# EasyEDA Pro project ProPrj_龙珠雷达_2024-11-02.epro

# Schematic SCH_龙珠雷达
Board Name: 龙珠雷达; Create Date: 2024-04-22; Page Name: P1; Project Name: 龙珠雷达; Schematic Name: SCH_龙珠雷达; Update Date: 2024-10-24; Company: 嘉立创EDA; Page Size: A4; Version: V1.0
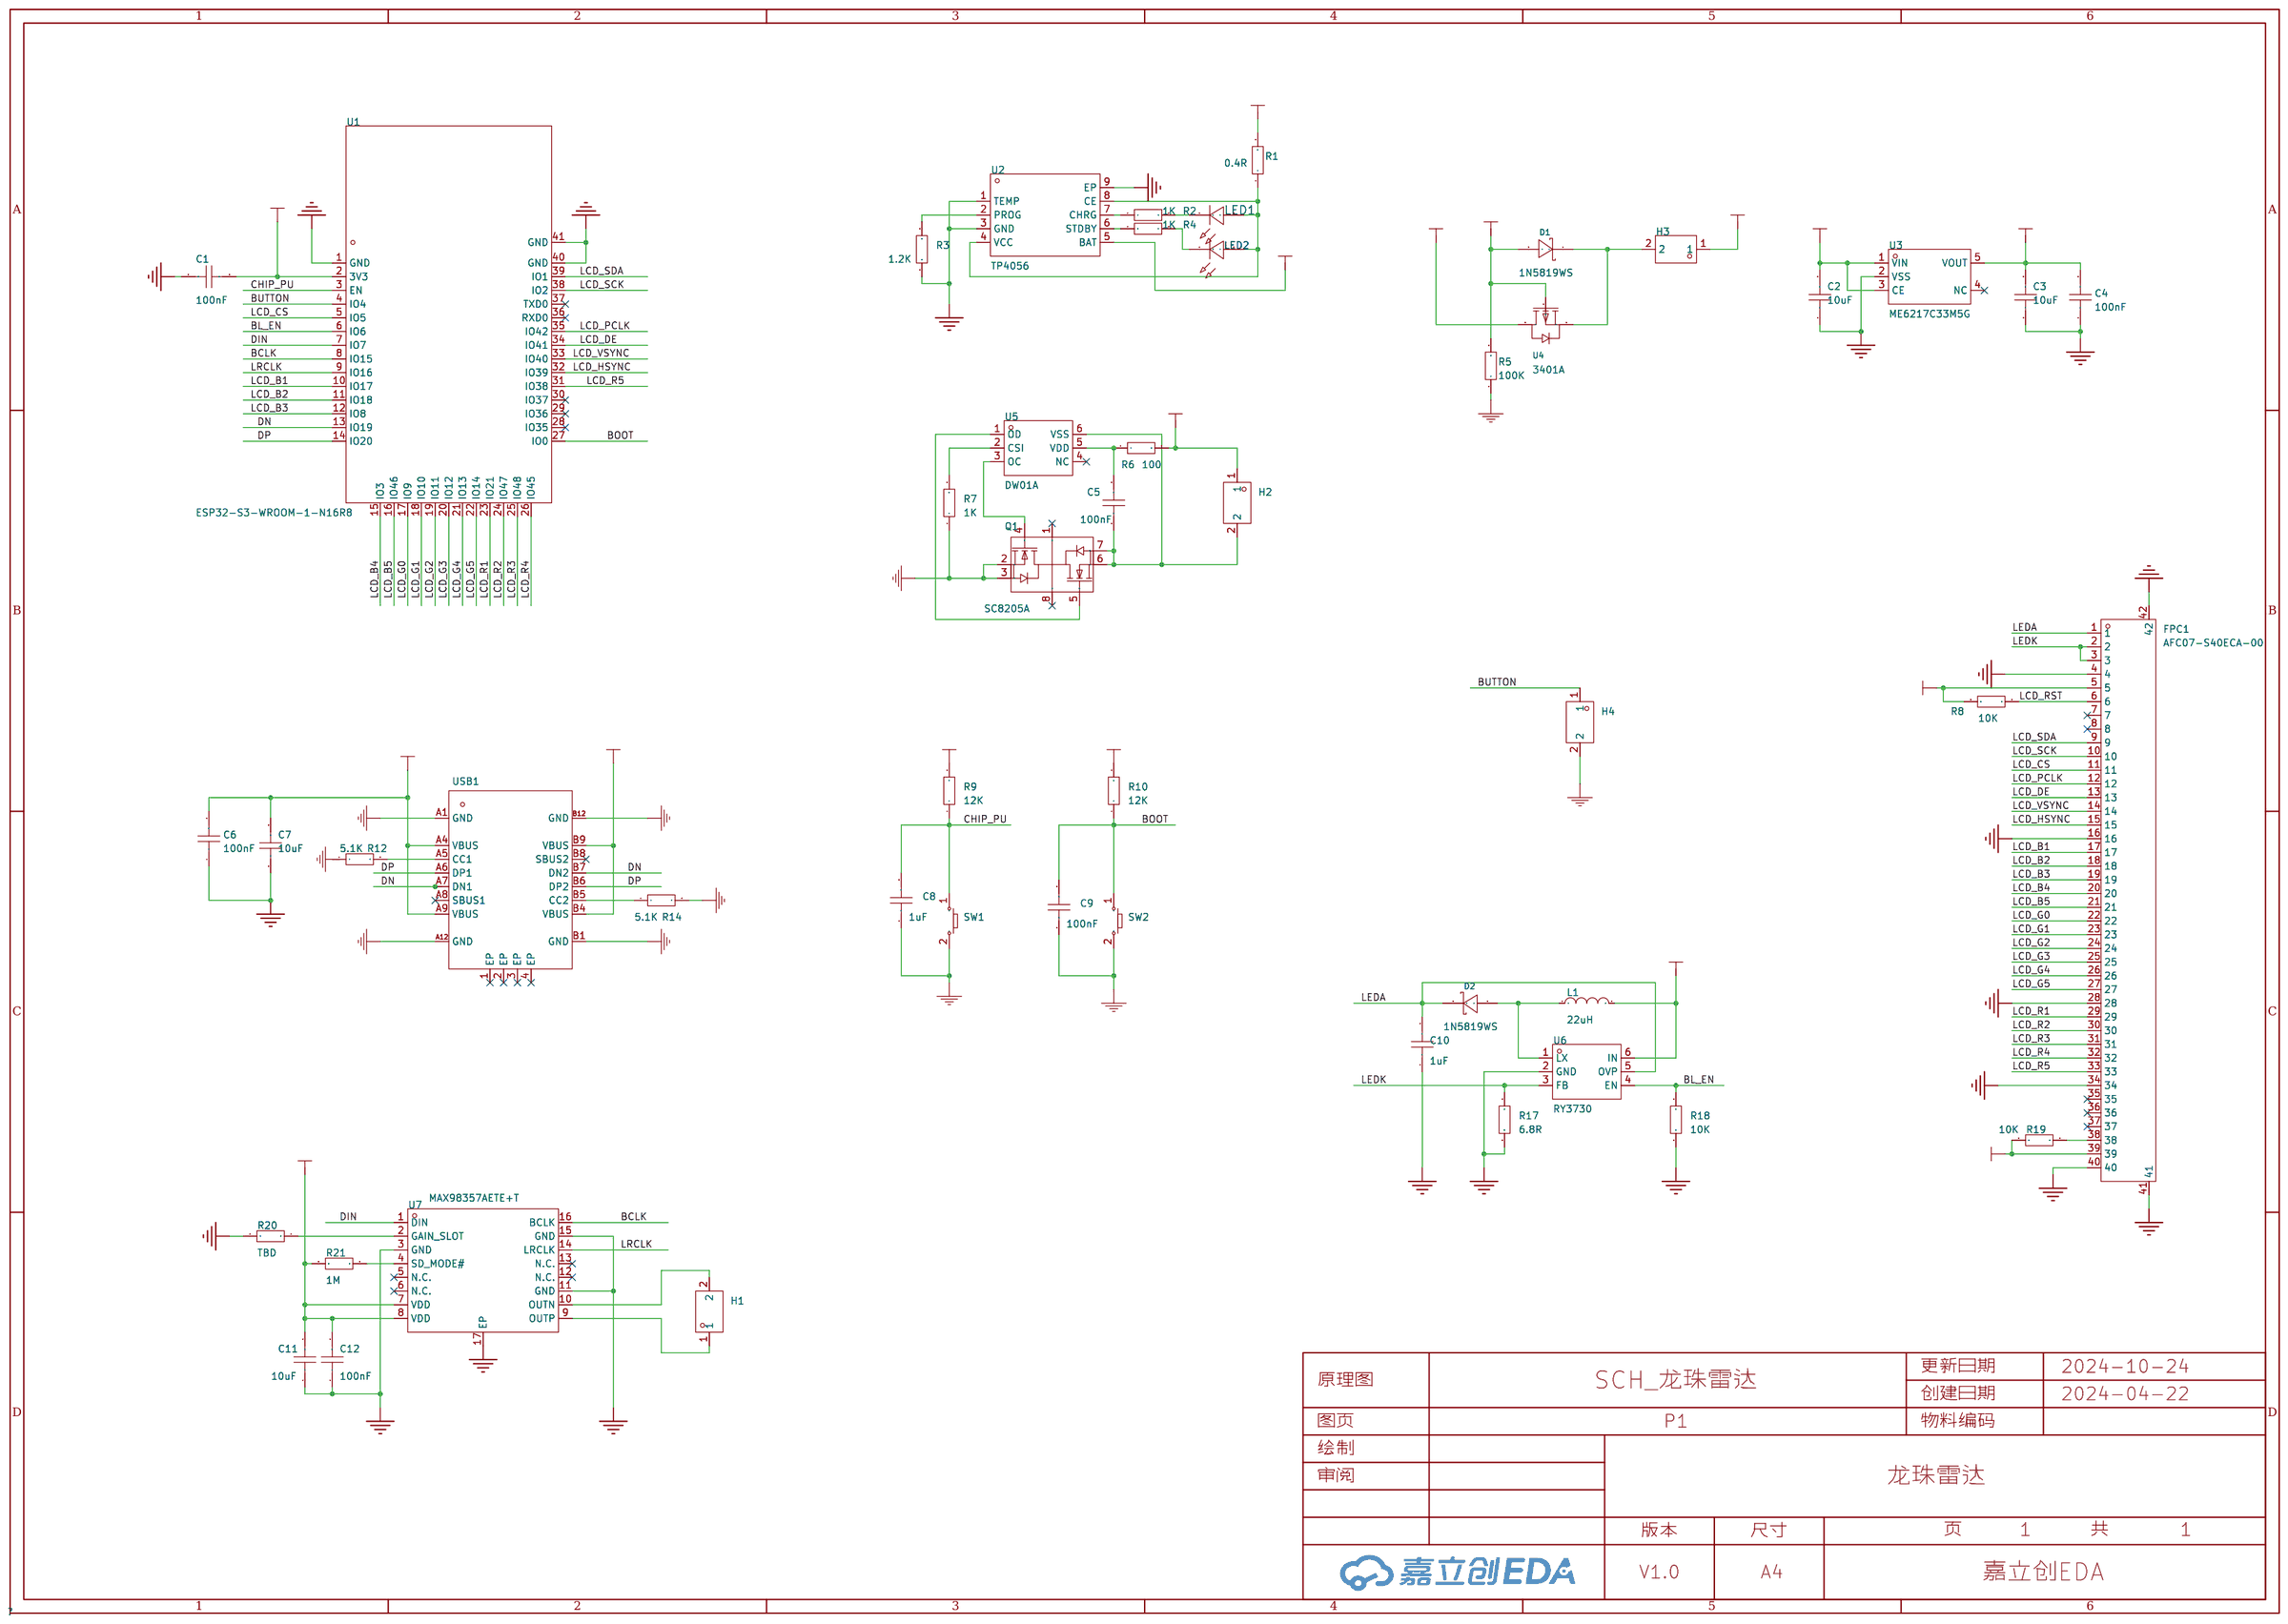
[diagram p0: schematic sheet]

## Parts
C1  100nF  [C0603]
C2  10uF  [C1206]
C3  10uF  [C1206]
C4  100nF  [C0603]
C5  100nF  [C0603]
C6  100nF  [C0603]
C7  10uF  [C1206]
C8  1uF  [C0603]
C9  100nF  [C0603]
C10  1uF  [C0603]
C11  10uF  [C0805]
C12  100nF  [C0603]
D1  1N5819WS  [SOD-323_L1.8-W1.3-LS2.5-RD]
D2  1N5819WS  [SOD-323_L1.8-W1.3-LS2.5-RD]
FPC1  AFC07-S40ECA-00  [FPC-SMD_P0.50-40P_LCS-SJ-H2.0]
H1  -  [HDR-TH_2P-P2.54-V-M-2]
H2  -  [HDR-TH_2P-P2.54-V-M-2]
H3  -  [HDR-TH_2P-P2.54-V-M-2]
H4  -  [HDR-TH_2P-P2.54-V-M-2]
L1  22uH  [IND-SMD_L4.5-W4.0_CD43]
LED1  -  [LED_0603]
LED2  -  [LED_0603]
Q1  SC8205A  [TSSOP-8_L4.4-W3.0-P0.65-LS6.4-BL]
R1  0.4R  [R0603]
R2  1K  [R0603]
R3  1.2K  [R0603]
R4  1K  [R0603]
R5  100K  [R0603]
R6  100  [R0603]
R7  1K  [R0603]
R8  10K  [R0603]
R9  12K  [R0603]
R10  12K  [R0603]
R12  5.1K  [R0603]
R14  5.1K  [R0603]
R17  6.8R  [R0603]
R18  10K  [R0603]
R19  10K  [R0603]
R20  TBD  [R0603]
R21  1M  [R0603]
SW1  -  [Key_SMD_3x4x2]
SW2  -  [Key_SMD_3x4x2]
U1  ESP32-S3-WROOM-1-N16R8  [WIRELM-SMD_ESP32-S3-WROOM-1]
U2  TP4056  [ESOP-8_L4.9-W3.9-P1.27-LS6.0-BL-EP]
U3  ME6217C33M5G  [SOT-23-5_L3.0-W1.7-P0.95-LS2.8-BR]
U4  3401A  [SOT-23-3_L2.9-W1.3-P1.90-LS2.4-BR]
U5  DW01A  [SOT-23-6_L2.9-W1.6-P0.95-LS2.8-BL]
U6  RY3730  [SOT-23-6_L2.9-W1.6-P0.95-LS2.8-BL]
U7  MAX98357AETE+T  [TQFN-16_L3.0-W3.0-P0.50-BL-EP1.5]
USB1  -  [USB_TYPE-C-16P]

## Library data of the parts
C1 C4-C6 C8-C10 C12 = CAP_0603: Supplier Footprint: 0603
C2 C3 C7 = CAP_1206: Supplier Footprint: 1206
C11 = CAP_0805: Supplier Footprint: 0805
D1 D2 = 1N5819WS_C191023: 直流反向耐压(Vr):40V;平均整流电流(Io):1A;正向压降(Vf):600mV@1A;; LCSC Part Name: 40V 1A 600mV@1A; Supplier Part: C191023; Manufacturer: Hottech(合科泰); Supplier Footprint: SOD-323; JLCPCB Part Class: 基础库; Datasheet: https://atta.szlcsc.com/upload/public/pdf/source/20220428/3CB86FD8D28D653594B4E35F9D5AEFD9.pdf; Supplier: LCSC; Reverse Voltage (Vr): 40V; Average Rectified Current (Io): 1A; Forward Voltage (Vf@If): 600mV@1A
FPC1 = AFC07-S40ECA-00: 锁定特性:抽屉式;触点类型:上接;触点数量:40P;间距:0.5mm;安装类型:卧贴;; LCSC Part Name: 间距:0.5mm P数:40P 抽屉式 上接; Supplier Part: C262648; Manufacturer: JS(钜硕电子); Supplier Footprint: SMD,P=0.5mm,卧贴; JLCPCB Part Class: 扩展库; Datasheet: https://atta.szlcsc.com/upload/public/pdf/source/20190726/C11082_A2E7B12387019CE4314BB5199EE0FDF4.pdf; Supplier: LCSC; Locking Feature: 抽屉式; Contact Type: 上接; Number of Contacts: 40P; Pitch: 0.5mm; Mounting Type: 卧贴; FFC, FCB Thickness: 0.3mm; Height Above Board: 2mm
H1-H4 = HDR-M_2.54_2x1: Supplier Part: C2883961; Supplier Footprint: 插件,P=2.54mm
L1 = CD43-220M 22UH: 电感值:22uH;精度:±20%;额定电流:760mA;类型:-;; LCSC Part Name: 22uH ±20%; Supplier Part: C2826645; Manufacturer: DMBJ(振宝佳); Supplier Footprint: SMD; JLCPCB Part Class: 扩展库; Datasheet: https://atta.szlcsc.com/upload/public/pdf/source/20210416/C2826610_BD9EF4281FEC8102FBF66339CC69A197.pdf; Supplier: LCSC; Tolerance: ±20%; Rated Current: 760mA; DC Resistance (DCR): 378mΩ
LED1 = LED_0603-R: Supplier Footprint: 0603
LED2 = LED_0603-G: Supplier Footprint: 0603
Q1 = SC8205A: 类型:N沟道;漏源电压(Vdss):20V;连续漏极电流(Id):6A;功率(Pd):2W;导通电阻(RDS(on)@Vgs,Id):25mΩ@10V,5A;阈值电压(Vgs(th)@Id):1.5V@250uA;; LCSC Part Name: N沟道 耐压:20V 电流:6A; Supplier Part: C83931; Manufacturer: FM(富满); Supplier Footprint: TSSOP-8; JLCPCB Part Class: 扩展库; Datasheet: https://atta.szlcsc.com/upload/public/pdf/source/20161024/1477288575793.pdf; Supplier: LCSC; Type: N沟道; Drain Source Voltage (Vdss): 20V; Continuous Drain Current (Id): 6A; Power Dissipation (Pd): 2W; Drain Source On Resistance (RDS(on)@Vgs,Id): 25mΩ@10V,5A; Gate Threshold Voltage (Vgs(th)@Id): 1.5V@250uA
R1-R10 R12 R14 R17-R21 = Res_0603: Supplier Footprint: 0603
SW1 SW2 = Key_SMD_3x4x2: Supplier Footprint: SMD
U1 = ESP32-S3-WROOM-1-N16R8: LCSC Part Name: 通用型Wi-Fi+低功耗蓝牙MCU模组; Supplier Part: C2913202; Manufacturer: ESPRESSIF(乐鑫); Supplier Footprint: SMD,18x25.5mm; JLCPCB Part Class: 扩展库; Datasheet: https://atta.szlcsc.com/upload/public/pdf/source/20220705/4E799F39581577F766659887F738A439.pdf; Supplier: LCSC
U2 = TP4056: Supplier Part: C9900002169; Supplier Footprint: ESOP-8; JLCPCB Part Class: 扩展库; Supplier: LCSC
U3 = ME6217C33M5G: 输出类型:固定;最大输入电压:7V;输出电压:3.3V;最大输出电流:800mA;电源纹波抑制比(PSRR):65dB@(1kHz);输出极性:正极;; LCSC Part Name: 输入7V 输出3.3V 800mA; Supplier Part: C427602; Manufacturer: MICRONE(南京微盟); Supplier Footprint: SOT-23-5; JLCPCB Part Class: 扩展库; Datasheet: https://atta.szlcsc.com/upload/public/pdf/source/20190910/C427602_D4B9162A2E9D9EF57C60010DFDECEF37.pdf; Supplier: LCSC; Output Type: 固定; Maximum Input Voltage: 7V; Output Voltage: 3.3V; MAX Output Current: 800mA; Power Supply Rejection Ratio (PSRR): 65dB@(1kHz); Dropout Voltage: 180mV@(300mA); Output Polarity: 正极; Number of Outputs: 1
U4 = 3401A: 类型:P沟道;漏源电压(Vdss):30V;连续漏极电流(Id):4.5A;导通电阻(RDS(on)@Vgs,Id):42mΩ;阈值电压(Vgs(th)@Id):1.3V;; LCSC Part Name: P沟道 耐压:30V 电流:4.5A; Supplier Part: C7431447; Manufacturer: HL(富海微); Supplier Footprint: SOT23; Datasheet: https://atta.szlcsc.com/upload/public/pdf/source/20230621/9CFCE0F782A34BEA1E30307D63B2C6A9.pdf; Supplier: LCSC; Type: P沟道; Drain Source Voltage (Vdss): 30V; Continuous Drain Current (Id): 4.5A; Drain Source On Resistance (RDS(on)@Vgs,Id): 42mΩ; Gate Threshold Voltage (Vgs(th)@Id): 1.3V
U5 = DW01A: 电源电压:-300mV~8V;最大充电电流:-;电池类型:锂离子/聚合物;电池节数:1;; Supplier Part: C2927799; Manufacturer: YONGYUTAI(永裕泰); Supplier Footprint: SOT-23-6; JLCPCB Part Class: 扩展库; Datasheet: https://atta.szlcsc.com/upload/public/pdf/source/20211207/8DC9CB9A742765EFB66910D35511359F.pdf; Supplier: LCSC; The Chip Type: 电池保护芯片; Supply Voltage: -300mV~8V; Type of Battery: 锂离子/聚合物; Number of Cells: 1; Operating Temperature: -40℃~+85℃
U6 = RY3730: LCSC Part Name: RY3730 WLED Driver, 2.5-5.5V, 8Series WLED Driver, 1.2MHz, SOT23-6; Supplier Part: C370887; Manufacturer: RYCHiP(蕊源); Supplier Footprint: SOT-23-6; JLCPCB Part Class: 扩展库; Datasheet: https://atta.szlcsc.com/upload/public/pdf/source/20190329/C370887_F149D316440A2ABDFE08FA1E0696DEE8.pdf; Supplier: LCSC
U7 = MAX98357AETE+T: 功放类型:-;扬声器通道数:单声道;输出功率:3.2Wx2@4Ω;; Supplier Part: C910544; Manufacturer: ADI(亚德诺)/MAXIM(美信); Supplier Footprint: TQFN-16-EP(3x3); JLCPCB Part Class: 扩展库; Datasheet: https://atta.szlcsc.com/upload/public/pdf/source/20210106/C910544_CB6DE4B2CEE254A72E6BDB40E718D281.pdf; Supplier: LCSC; Speaker Channels: 单声道; Output Power: 3.2Wx2@4Ω; Supply Voltage: 2.5V~5.5V; Operating Temperature: -40℃~+85℃
USB1 = USB_TYPE-C-16P: Supplier Footprint: SMD

## Nets
3V3: C1.1 C3.2 C4.2 FPC1.5 FPC1.39 R8.2 R9.2 R10.2 R19.2 U1.2(3V3) U3.5(VOUT)
GND: C1.2 C2.1 C3.1 C4.1 C6.1 C7.1 C8.1 C9.1 C10.1 C11.1 C12.1 FPC1.4 FPC1.16 FPC1.28 FPC1.34 FPC1.40 FPC1.41 FPC1.42 H4.2 Q1.2(S1) Q1.3(S1) R3.1 R5.1 R7.1 R12.1 R14.2 R17.2 R18.2 R20.2 SW1.2 SW2.2 U1.1(GND) U1.40(GND) U1.41(GND) U2.1(TEMP) U2.3(GND) U2.9(EP) U3.2(VSS) U6.2(GND) U7.3(GND) U7.11(GND) U7.15(GND) U7.17(EP) USB1.A1(GND) USB1.A12(GND) USB1.B1(GND) USB1.B12(GND)
BAT+: H2.1 R6.2 U2.5(BAT) U4.3(D)
BCLK: U1.8(IO15) U7.16(BCLK)
BL_EN: R18.1 U1.6(IO6) U6.4(EN)
BOOT: C9.2 R10.1 SW2.1 U1.27(IO0)
BUTTON: H4.1 U1.4(IO4)
CHIP_PU: C8.2 R9.1 SW1.1 U1.3(EN)
DIN: U1.7(IO7) U7.1(DIN)
DN: U1.13(IO19) USB1.A7(DN1) USB1.B7(DN2)
DP: U1.14(IO20) USB1.A6(DP1) USB1.B6(DP2)
LCD_B1: FPC1.17 U1.10(IO17)
LCD_B2: FPC1.18 U1.11(IO18)
LCD_B3: FPC1.19 U1.12(IO8)
LCD_B4: FPC1.20 U1.15(IO3)
LCD_B5: FPC1.21 U1.16(IO46)
LCD_CS: FPC1.11 U1.5(IO5)
LCD_DE: FPC1.13 U1.34(IO41)
LCD_G0: FPC1.22 U1.17(IO9)
LCD_G1: FPC1.23 U1.18(IO10)
LCD_G2: FPC1.24 U1.19(IO11)
LCD_G3: FPC1.25 U1.20(IO12)
LCD_G4: FPC1.26 U1.21(IO13)
LCD_G5: FPC1.27 U1.22(IO14)
LCD_HSYNC: FPC1.15 U1.32(IO39)
LCD_PCLK: FPC1.12 U1.35(IO42)
LCD_R1: FPC1.29 U1.23(IO21)
LCD_R2: FPC1.30 U1.24(IO47)
LCD_R3: FPC1.31 U1.25(IO48)
LCD_R4: FPC1.32 U1.26(IO45)
LCD_R5: FPC1.33 U1.31(IO38)
LCD_RST: FPC1.6 R8.1
LCD_SCK: FPC1.10 U1.38(IO2)
LCD_SDA: FPC1.9 U1.39(IO1)
LCD_VSYNC: FPC1.14 U1.33(IO40)
LEDA: C10.2 D2.1(K) FPC1.1 U6.5(OVP)
LEDK: FPC1.2 FPC1.3 R17.1 U6.3(FB)
LRCLK: U1.9(IO16) U7.14(LRCLK)
VSYS: C2.2 C11.2 C12.2 H3.1 L1.2 R21.2 U3.1(VIN) U3.3(CE) U6.6(IN) U7.7(VDD) U7.8(VDD)
VUSB: C6.2 C7.2 D1.2(A) R1.2 R5.2 U4.1(G) USB1.A4(VBUS) USB1.A9(VBUS) USB1.B4(VBUS) USB1.B9(VBUS)
$1N1235: R2.1 U2.7(CHRG)
$1N1236: R4.1 U2.6(STDBY)
$1N1237: LED1.1(C) R2.2
$1N1238: LED2.1(C) R4.2
$1N1240: R3.2 U2.2(PROG)
$1N1241: LED1.2(A) LED2.2(A) R1.1 U2.4(VCC) U2.8(CE)
$1N1243: R7.2 U5.2(CSI)
$1N1244: Q1.4(G1) U5.3(OC)
$1N1245: Q1.5(G2) U5.1(OD)
$1N1246: C5.2 R6.1 U5.5(VDD)
$1N7025: FPC1.38 R19.1
$1N8594: R12.2 USB1.A5(CC1)
$1N8596: R14.1 USB1.B5(CC2)
$1N11286: D2.2(A) L1.1 U6.1(LX)
$1N12849: R21.1 U7.4(SD_MODE#)
$1N12853: R20.1 U7.2(GAIN_SLOT)
$1N12856: H1.2 U7.10(OUTN)
$1N12857: H1.1 U7.9(OUTP)
$1N14888: D1.1(K) H3.2 U4.2(S)
$1N21558: C5.1 H2.2 Q1.6(S2) Q1.7(S2) U5.6(VSS)

Not connected (* = marked no-connect by the designer): FPC1 7* 8* 35* 36* 37*; Q1 1(D12)* 8(D12)*; U1 28(IO35)* 29(IO36)* 30(IO37)* 36(RXD0)* 37(TXD0)*; U3 4(NC)*; U5 4(NC)*; U7 5(N.C.)* 6(N.C.)* 12(N.C.)* 13(N.C.)*; USB1 1(EP)* 2(EP)* 3(EP)* 4(EP)* A8(SBUS1)* B8(SBUS2)*

# Board PCB_龙珠雷达
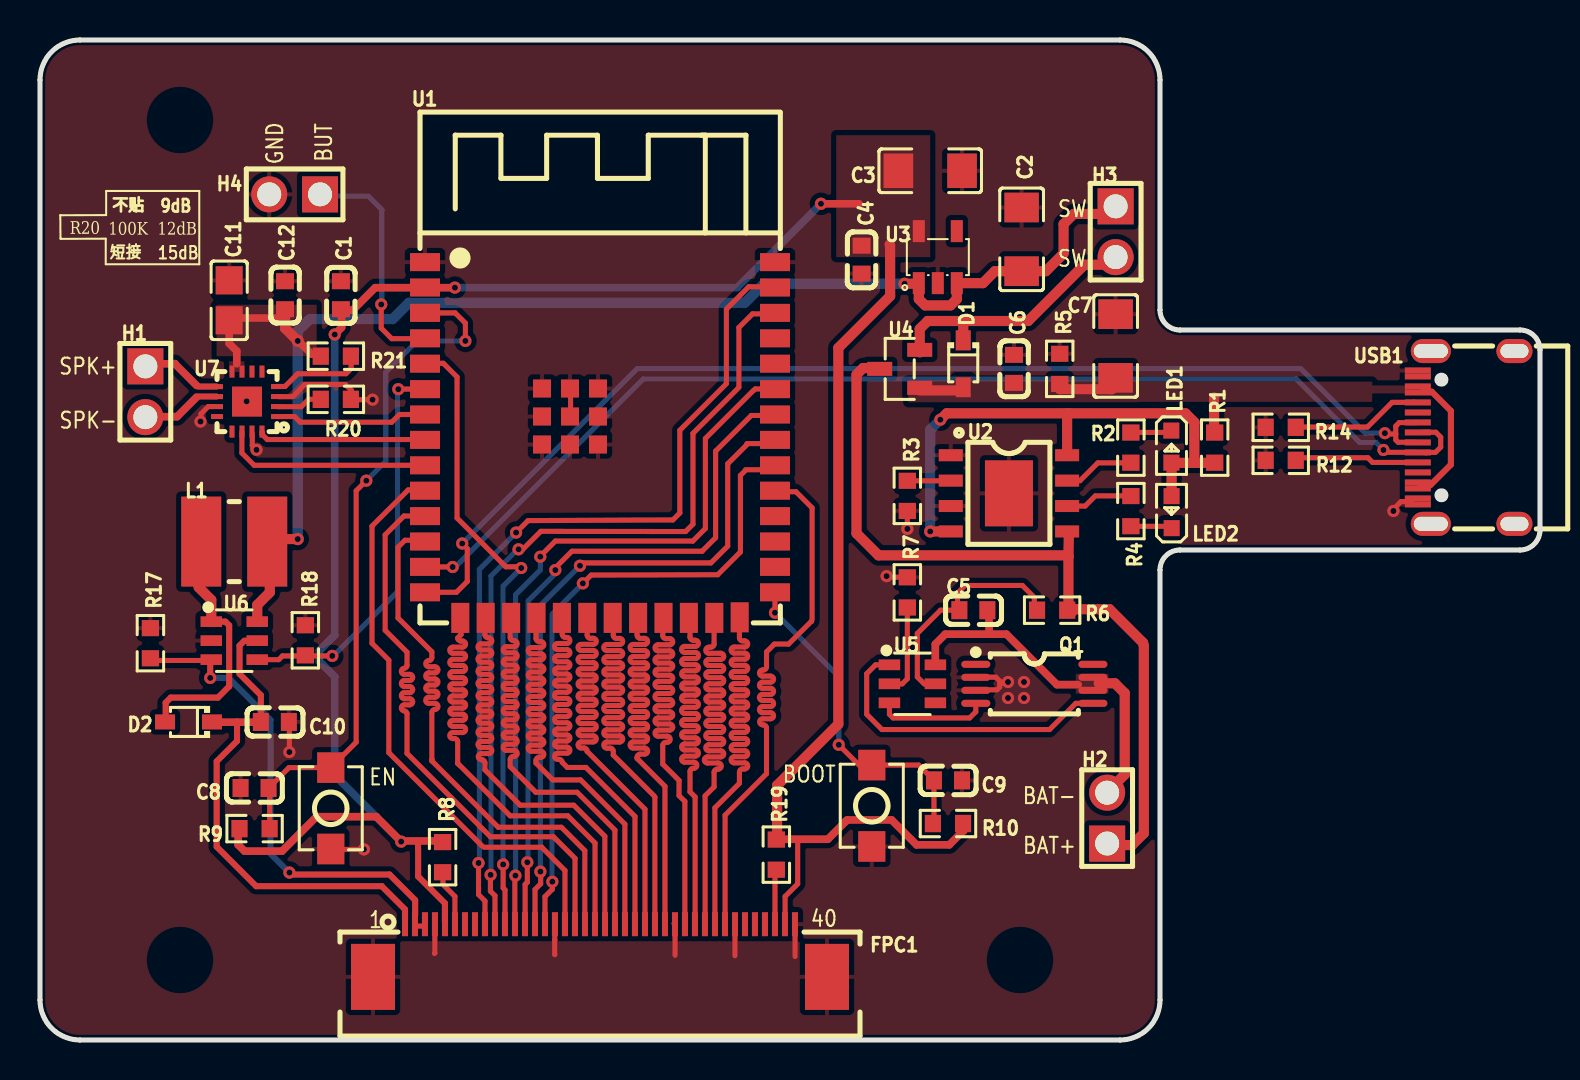
[diagram p1: board, top side]
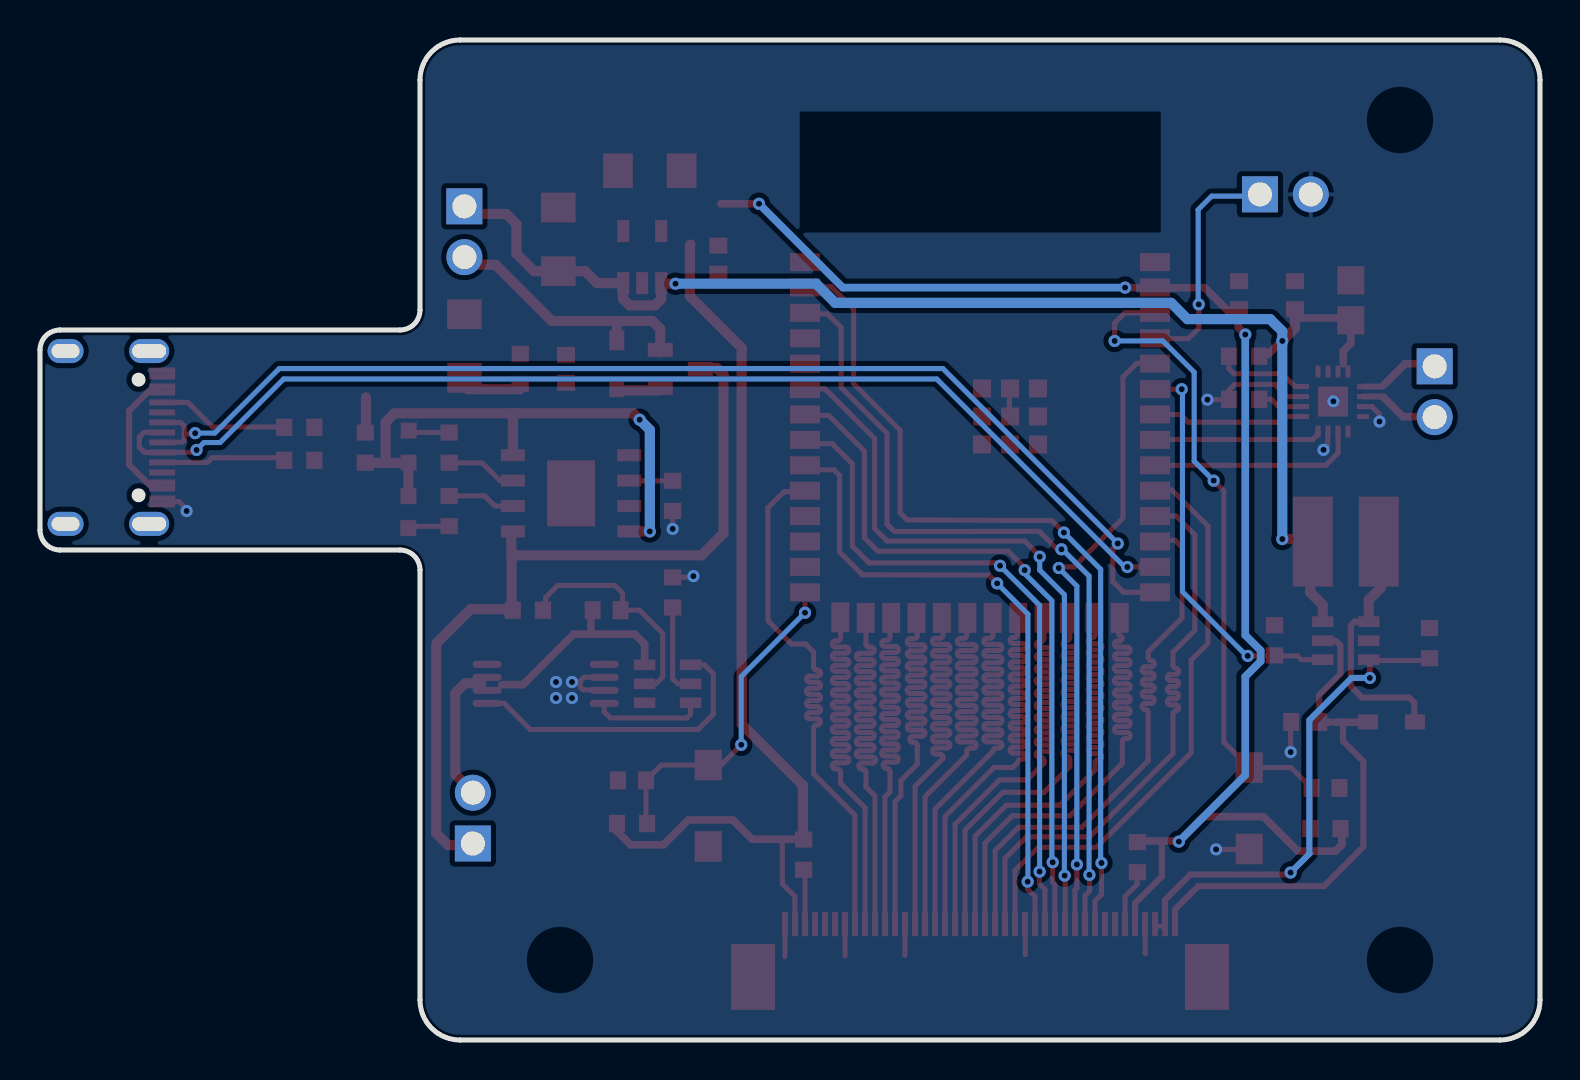
[diagram p2: board, bottom side, seen from below]

Outline 75 x 50 mm; copper layers: Top Layer, Bottom Layer. Coordinates in mm from the lower left corner of the outline.
Outline path: 0,48 0,2 arc(0.59,0.59) 2,0 54,0 arc(55.41,0.59) 56,2 56,23.5 arc(56.29,24.21) 57,24.5 74,24.5 arc(74.71,24.79) 75,25.5 75,34.5 arc(74.71,35.21) 74,35.5 57,35.5 arc(56.29,35.79) 56,36.5 56,48 arc(55.41,49.41) 54,50 2,50 arc(0.59,49.41) 0,48
Stack: Top Layer 0.035mm / Dielectric1 1.51mm FR4 er 4.5 / Bottom Layer 0.035mm

## Design rules (mm)
template: JLCPCB Capability(Two Layers Board)
spacing copperThickness1oz (default): track to track 0.102, other pairs 0.152 to 0.3
spacing copperThickness2oz: track to track 0.203, other pairs 0.152 to 0.3
track width copperThickness1oz (default): min 0.127, default 0.254, max 2.54
track width copperThickness2oz: min 0.203, default 0.254, max 2.54
differential pair differentialPair (default): width min 0.127, default 0.254, max 2.54; gap min 0.152, default 0.152
via viaSize (default): diameter min 0.5, default 0.61, max 10; hole min 0.3, default 0.305, max 6.3

## Placement (name value [footprint] x y rotation side)
C1  100nF  [C0603]  15.05 37.24 90 top
C2  10uF  [C1206]  49.08 40.03 270 top
C3  10uF  [C1206]  44.51 43.46 180 top
C4  100nF  [C0603]  41.08 39.02 90 top
C5  100nF  [C0603]  46.67 21.49 180 top
C6  100nF  [C0603]  48.7 33.56 270 top
C7  10uF  [C1206]  53.78 34.7 270 top
C8  1uF  [C0603]  10.73 12.6 0 top
C9  100nF  [C0603]  45.4 12.98 180 top
C10  1uF  [C0603]  11.74 15.9 180 top
C11  10uF  [C0805]  9.46 36.98 270 top
C12  100nF  [C0603]  12.25 37.24 270 top
D1  1N5819WS  [SOD-323_L1.8-W1.3-LS2.5-RD]  46.16 33.81 270 top
D2  1N5819WS  [SOD-323_L1.8-W1.3-LS2.5-RD]  7.43 15.9 180 top
FPC1  AFC07-S40ECA-00  [FPC-SMD_P0.50-40P_LCS-SJ-H2.0]  28 4.47 180 top
H1  -  [HDR-TH_2P-P2.54-V-M-2]  5.27 32.41 180 top
H2  -  [HDR-TH_2P-P2.54-V-M-2]  53.36 11.09 0 top
H3  -  [HDR-TH_2P-P2.54-V-M-2]  53.78 40.41 180 top
H4  -  [HDR-TH_2P-P2.54-V-M-2]  12.73 42.28 90 top
L1  22uH  [IND-SMD_L4.5-W4.0_CD43]  9.71 24.92 0 top
LED1  -  [LED_0603]  56.57 29.62 270 top
LED2  -  [LED_0603]  56.57 26.44 90 top
Q1  SC8205A  [TSSOP-8_L4.4-W3.0-P0.65-LS6.4-BL]  49.72 17.81 270 top
R1  0.4R  [R0603]  58.73 29.62 90 top
R2  1K  [R0603]  54.54 29.62 90 top
R3  1.2K  [R0603]  43.37 27.21 90 top
R4  1K  [R0603]  54.54 26.44 270 top
R5  100K  [R0603]  50.99 33.56 270 top
R6  100  [R0603]  50.61 21.49 0 top
R7  1K  [R0603]  43.37 22.38 270 top
R8  10K  [R0603]  20.13 9.14 90 top
R9  12K  [R0603]  10.73 10.57 180 top
R10  12K  [R0603]  45.4 10.82 0 top
R12  5.1K  [R0603]  62.04 28.98 0 top
R14  5.1K  [R0603]  62.04 30.64 180 top
R17  6.8R  [R0603]  5.52 19.84 90 top
R18  10K  [R0603]  13.27 19.98 90 top
R19  10K  [R0603]  36.82 9.27 90 top
R20  TBD  [R0603]  14.79 32.03 0 top
R21  1M  [R0603]  14.79 34.19 180 top
SW1  -  [Key_SMD_3x4x2]  14.54 11.58 270 top
SW2  -  [Key_SMD_3x4x2]  41.59 11.71 270 top
U1  ESP32-S3-WROOM-1-N16R8  [WIRELM-SMD_ESP32-S3-WROOM-1]  28 30 0 top
U2  TP4056  [ESOP-8_L4.9-W3.9-P1.27-LS6.0-BL-EP]  48.45 27.33 270 top
U3  ME6217C33M5G  [SOT-23-5_L3.0-W1.7-P0.95-LS2.8-BR]  44.89 39.14 270 top
U4  3401A  [SOT-23-3_L2.9-W1.3-P1.90-LS2.4-BR]  42.99 33.56 0 top
U5  DW01A  [SOT-23-6_L2.9-W1.6-P0.95-LS2.8-BL]  43.62 17.81 270 top
U6  RY3730  [SOT-23-6_L2.9-W1.6-P0.95-LS2.8-BL]  9.71 19.97 270 top
U7  MAX98357AETE+T  [TQFN-16_L3.0-W3.0-P0.50-BL-EP1.5]  10.35 31.92 90 top
USB1  -  [USB_TYPE-C-16P]  71.31 30 90 top

## Footprints (pads in the part's own frame, mm; a bottom-side part is the same pattern mirrored in y, then rotated)
C0603
  rect 0.8x0.9 smd: 1(-0.7,0) 2(0.7,0)
C0805
  rect 1.41x1.35 smd: 1(-1,0) 2(1,0)
C1206
  rect 1.485x1.728 smd: 1(-1.593,0) 2(1.593,0)
ESOP-8_L4.9-W3.9-P1.27-LS6.0-BL-EP
  rect 0.6x1.2 smd: 1(-1.905,-2.909) 2(-0.635,-2.909) 3(0.635,-2.909) 4(1.905,-2.909) 5(1.905,2.909) 6(0.635,2.909) 7(-0.635,2.909) 8(-1.905,2.909)
  rect 3.3x2.4 smd: 9(0,0)
FPC-SMD_P0.50-40P_LCS-SJ-H2.0
  rect 0.3x1.2 smd: 1(9.751,-1.318) 2(9.252,-1.318) 3(8.753,-1.318) 4(8.252,-1.318) 5(7.752,-1.318) 6(7.252,-1.318) 7(6.752,-1.318) 8(6.251,-1.318) 9(5.753,-1.318) 10(5.253,-1.318) 11(4.753,-1.318) 12(4.252,-1.318) 13(3.752,-1.318) 14(3.251,-1.318) 15(2.752,-1.318) 16(2.253,-1.318) 17(1.752,-1.318) 18(1.252,-1.318) 19(0.752,-1.318) 20(0.252,-1.318) 21(-0.249,-1.318) 22(-0.748,-1.318) 23(-1.247,-1.318) 24(-1.748,-1.318) 25(-2.248,-1.318) 26(-2.748,-1.318) 27(-3.248,-1.318) 28(-3.749,-1.318) 29(-4.247,-1.318) 30(-4.747,-1.318) 31(-5.247,-1.318) 32(-5.748,-1.318) 33(-6.248,-1.318) 34(-6.749,-1.318) 35(-7.248,-1.318) 36(-7.747,-1.318) 37(-8.248,-1.318) 38(-8.748,-1.318) 39(-9.248,-1.318) 40(-9.748,-1.318)
  rect 2.2x3.3 smd: 41(11.35,1.318) 42(-11.35,1.318)
HDR-TH_2P-P2.54-V-M-2
  rect 1.8x1.8 hole 1.2: 1(0,-1.27)
  round 1.8 hole 1.2: 2(0,1.27)
IND-SMD_L4.5-W4.0_CD43
  rect 2x4.5 smd: 1(-1.65,0) 2(1.65,0)
Key_SMD_3x4x2
  rect 1.53x1.36 smd: 1(-2.035,0) 2(2.035,0)
LED_0603
  rect 0.8x0.8 smd: 1(-0.851,-0.01) 2(0.75,-0.005)
R0603
  rect 0.806x0.864 smd: 1(-0.753,0) 2(0.753,0)
SOD-323_L1.8-W1.3-LS2.5-RD
  rect 1x0.75 smd: 1(-1.173,0) 2(1.173,0)
SOT-23-3_L2.9-W1.3-P1.90-LS2.4-BR
  rect 1.25x0.7 smd: 1(1,-0.95) 2(1,0.95) 3(-1,0)
SOT-23-5_L3.0-W1.7-P0.95-LS2.8-BR
  rect 1.1x0.6 smd: 1(1.3,-0.95) 2(1.3,0) 3(1.3,0.95) 4(-1.3,0.95) 5(-1.3,-0.95)
SOT-23-6_L2.9-W1.6-P0.95-LS2.8-BL
  rect 0.532x1.072 smd: 1(-0.95,-1.149) 2(0,-1.149) 3(0.95,-1.149) 4(0.95,1.149) 5(0,1.149) 6(-0.95,1.149)
TQFN-16_L3.0-W3.0-P0.50-BL-EP1.5
  rect 0.25x0.6 smd: 1(-0.749,-1.5) 2(-0.248,-1.5) 3(0.252,-1.5) 4(0.751,-1.5) 9(0.75,1.5) 10(0.25,1.5) 11(-0.25,1.5) 12(-0.749,1.5)
  rect 0.6x0.25 smd: 5(1.5,-0.748) 6(1.5,-0.248) 7(1.5,0.252) 8(1.5,0.752) 13(-1.5,0.752) 14(-1.5,0.252) 15(-1.5,-0.248) 16(-1.5,-0.748)
  rect 1.5x1.5 smd: 17(0,0)
TSSOP-8_L4.4-W3.0-P0.65-LS6.4-BL
  oval 0.353x1.454 smd: 1(-0.975,-2.927) 2(-0.325,-2.927) 3(0.325,-2.927) 4(0.975,-2.927) 5(0.975,2.927) 6(0.325,2.927) 7(-0.325,2.927) 8(-0.975,2.927)
USB_TYPE-C-16P
  oval 1.2x2 hole 0.7x1.7: 1(-4.193,1.765) 2(4.447,1.765)
  oval 1.2x1.8 hole 0.7x1.4: 3(-4.193,-2.415) 4(4.447,-2.415)
  rect 0.3x1.3 smd: A1(-3.223,2.415) A4(-2.423,2.415) A5(-1.123,2.415) A6(-0.123,2.415) A7(0.377,2.415) A8(1.377,2.415) A9(2.677,2.415) A12(3.477,2.415) B1(3.177,2.415) B4(2.377,2.415) B5(1.877,2.415) B6(0.877,2.415) B7(-0.623,2.415) B8(-1.623,2.415) B9(-2.123,2.415) B12(-2.923,2.415)
WIRELM-SMD_ESP32-S3-WROOM-1
  rect 1.5x0.9 smd: 1(-8.75,8.895) 2(-8.75,7.625) 3(-8.75,6.355) 4(-8.75,5.085) 5(-8.75,3.815) 6(-8.75,2.545) 7(-8.75,1.275) 8(-8.75,0.005) 9(-8.75,-1.265) 10(-8.75,-2.535) 11(-8.75,-3.805) 12(-8.75,-5.075) 13(-8.75,-6.345) 14(-8.75,-7.615) 27(8.75,-7.615) 28(8.75,-6.345) 29(8.75,-5.075) 30(8.75,-3.805) 31(8.75,-2.535) 32(8.75,-1.265) 33(8.75,0.005) 34(8.75,1.275) 35(8.75,2.545) 36(8.75,3.815) 37(8.75,5.085) 38(8.75,6.355) 39(8.75,7.625) 40(8.75,8.895)
  rect 0.9x1.5 smd: 15(-6.985,-8.895) 16(-5.715,-8.895) 17(-4.445,-8.895) 18(-3.175,-8.895) 19(-1.905,-8.895) 20(-0.635,-8.895) 21(0.635,-8.895) 22(1.905,-8.895) 23(3.175,-8.895) 24(4.445,-8.895) 25(5.715,-8.895) 26(6.985,-8.865)
  rect 0.9x0.9 smd: 41(-2.9,2.575) 41(-2.9,1.175) 41(-2.9,-0.225) 41(-1.5,2.575) 41(-1.5,1.175) 41(-1.5,-0.225) 41(-0.1,2.575) 41(-0.1,1.175) 41(-0.1,-0.225)

## Nets
As in the schematic.

Pads without a net: FPC1 7 8 35 36 37; Q1 1 8; U1 28 29 30 36 37; U3 4; U5 4; U7 5 6 12 13; USB1 1 2 3 4 A8 B8

## Via types
v1: diameter 0.61, hole 0.305, Top Layer to Bottom Layer, 49 vias

## Routing (per net, layer and track width the routed paths; a pad name or vN(x,y) marks a point on that pad's centre or on a via; arc(x,y) is an arc through that point)
3V3: length 120.3
  Top Layer w0.254: 37.26,6.32 37.26,7.18 37.88,7.81 37.88,9.97 37.92,10.01
  Top Layer w0.305: 20.25,5.91 20.25,6.83 18.91,8.17 18.91,9.58 ; 18.9,9.89 18.9,9.88 18.9,9.62
  Top Layer w0.381: 40.31,10.95 39.4,10.04 36.91,10.04 ; 40.31,10.95 40.36,11 42.58,11 43.83,9.76 45.46,9.76 46.16,10.46 ; 40.31,10.95 40.29,10.95 ; 36.91,10.04 36.86,10.04 ; 36.91,10.04 36.86,10.04 ; 18.14,9.86 18.15,9.87 ; v1(20.75,37.62) 20.74,37.61 16.76,37.61 15.63,36.49 15.09,36.49 15.08,36.5 ; 46.19,10.46 46.16,10.46 46.16,10.48 ; C1.1 15.08,36.5 ; 15.08,36.5 15.08,35.62 14.79,35.33 ; 9.92,10.5 9.92,10.32 9.91,10.31 9.91,9.76 10.23,9.44 12.1,9.44 13.83,11.17 16.81,11.17 v1(18.06,9.92) 18.07,9.91 ; 40.95,41.81 v1(39.05,41.81) ; 20.1,9.96 20.1,9.95 18.11,9.95
  Top Layer w0.508: 42.48,39.77 42.51,39.74 42.51,37.19 39.92,34.6 39.92,15.79 36.85,12.73 36.85,10.02
  Bottom Layer w0.381: v1(39.05,41.81) 34.86,37.62 v1(20.75,37.62) ; v1(18.06,9.92) 14.74,13.24 14.74,18.17 13.97,18.94 13.97,19.47 14.74,20.24 v1(14.74,35.27)
GND: length 24.1
  Top Layer w0.254: v1(10.83,29.51) 10.62,29.72 10.62,30.32 ; 34.76,5.75 34.75,5.73 34.75,4.21 ; 42.35,23.14 43.31,23.14 43.34,23.17 ; 11.93,32.17 12.63,32.17 13.23,32.78 15.27,32.78 15.57,32.47 15.57,32.19 ; 8.05,30.97 8.05,31.31 8.41,31.67 8.64,31.67 ; 26.53,31.3 26.53,32.48 26.45,32.56 ; 12.47,15.8 12.47,14.35 12.45,14.34 ; v1(67.67,26.45) 67.67,26.54 68.05,26.92 68.55,26.92 68.55,26.86 ; 46.92,17.48 46.95,17.51 47.85,17.51 47.98,17.64 47.98,17.95 47.79,18.14 47.19,18.14 ; 37.75,4.17 37.75,5.38 37.74,5.39 ; 48.02,17.83 48.4,17.83 48.4,17.83 ; v1(16.63,32.02) 15.73,32.02 15.69,32.06 ; 19.74,5.42 19.74,4.34 19.72,4.32 ; 14.52,9.53 v1(16.2,9.53) ; 25.72,5.37 25.72,5.35 25.74,5.34 25.74,4.99 25.73,4.98 25.73,4.27 25.74,4.27 ; R3.1 v1(43.37,25.56) ; 31.7,5.82 31.75,5.77 31.75,4.23
  Bottom Layer w0.254: 42.41,23.17 42.39,23.19 v1(42.33,23.19) ; 67.64,26.46 67.66,26.45 v1(67.67,26.45)
  vias: v1(8.03,30.92) v1(10.33,31.93) v1(12.47,14.4) v1(48.4,17.9) v1(48.4,17.1) v1(49.2,17.9) v1(49.2,17.1)
BAT+: length 40
  Top Layer w0.508: 53.47,9.63 53.58,9.75 54.6,9.75 55.19,10.34 55.19,19.7 55.15,19.86 53.47,21.54 51.74,21.54 51.62,21.42 ; 51.42,24.18 51.42,24.19 51.38,24.23 41.92,24.23 40.83,25.33 40.83,33.27 41.16,33.6 41.83,33.6 41.88,33.54 ; 51.42,24.18 51.42,21.48 51.4,21.46 ; 51.42,24.18 51.44,25.25 51.37,25.33
BCLK: length 8.4
  Top Layer w0.254: U1.8 19.23,30.02 11.36,30.02 11.11,30.28 11.11,30.39 11.09,30.41
BL_EN: length 19.9
  Top Layer w0.254: v1(14.61,19.2) 13.29,19.2 R18.1 13.24,19.2 12.12,19.2 11.94,19.02 U6.4 ; v1(17.91,32.54) 17.92,32.55 U1.6
  Bottom Layer w0.254: v1(17.91,32.54) 17.88,32.5 17.88,22.42 14.67,19.2 v1(14.61,19.2)
BOOT: length 16.6
  Top Layer w0.254: U1.27 v1(36.75,21.36) ; v1(39.94,14.76) 40.95,13.75 SW2.1 43.93,13.75 C9.2 44.7,10.9 44.77,10.82
  Bottom Layer w0.254: v1(36.75,21.36) 39.94,18.18 v1(39.94,14.76)
BUTTON: length 11.5
  Top Layer w0.254: v1(17.06,36.78) 17.06,35.59 17.59,35.07 19.11,35.07 19.19,34.98
  Bottom Layer w0.254: 17.1,41.51 16.42,42.19 14.15,42.19 ; v1(17.06,36.78) 17.09,36.81 17.09,41.49
CHIP_PU: length 34.2
  Top Layer w0.254: R9.1 11.48,12.55 C8.2 12.45,13.62 SW1.1 15.81,14.89 15.81,27.46 v1(16.32,27.97) ; v1(21.27,34.95) 21.27,35.84 20.76,36.36 U1.3
  Bottom Layer w0.254: v1(21.27,34.95) 18.86,34.95 17.29,33.39 17.29,28.94 v1(16.32,27.97)
DIN: length 7.7
  Top Layer w0.254: U1.7 17.97,31.28 17.59,30.89 13.01,30.89 12.73,31.17 11.86,31.17
DN: length 57.2
  Top Layer w0.254: 68.72,29.39 68.71,29.38 67.32,29.38 67.19,29.52 ; v1(20.63,23.65) 20.63,23.66 U1.13 ; 69.31,29.36 69.34,29.38 69.77,29.38 ; 69.79,29.4 70.04,29.64 70.04,30.14 69.79,30.39 69.16,30.39
  Bottom Layer w0.254: v1(20.63,23.65) 20.76,23.65 30.16,33.05 62.82,33.05 66,29.87 66.8,29.87 v1(67.17,29.5)
DP: length 58.8
  Top Layer w0.254: v1(21.11,24.83) 21.36,24.57 21.36,22.93 20.82,22.39 U1.14 ; v1(67.24,30.34) 67.28,30.3 67.79,30.3 67.79,30 67.91,29.89 68.77,29.89 ; 68.81,30.89 68.79,30.87 67.96,30.87 67.79,30.69 67.79,30.32
  Bottom Layer w0.254: v1(21.11,24.83) 29.86,33.57 63.04,33.57 66.26,30.35 67.24,30.35 v1(67.24,30.34)
LCD_B1: length 28.6
  Top Layer w0.254: 22.12,9.68 17.44,14.37 17.44,18.99 16.6,19.83 16.6,25.7 18.41,27.5 19.01,27.5 ; 26.25,5.86 26.25,8.48 25.09,9.64 22.2,9.64
LCD_B2: length 30
  Top Layer w0.254: 19.14,26.2 18.2,26.2 17.26,25.26 17.26,20.48 18.35,19.39 18.35,18.73 arc(18.31,18.63) 18.21,18.59 arc(18.11,18.55) 18.07,18.45 18.07,18.42 arc(18.11,18.32) 18.21,18.28 18.49,18.28 arc(18.59,18.24) 18.63,18.14 18.63,18.12 arc(18.59,18.02) 18.49,17.98 18.21,17.98 arc(18.11,17.94) 18.07,17.84 18.07,17.81 arc(18.11,17.71) 18.21,17.67 18.49,17.67 arc(18.59,17.63) 18.63,17.53 18.63,17.51 arc(18.59,17.41) 18.49,17.37 18.21,17.37 arc(18.11,17.33) 18.07,17.23 18.07,17.2 arc(18.11,17.1) 18.21,17.06 18.49,17.06 arc(18.59,17.02) 18.63,16.92 18.63,16.9 arc(18.59,16.8) 18.49,16.76 18.21,16.76 arc(18.11,16.72) 18.07,16.62 18.07,16.59 arc(18.11,16.5) 18.21,16.45 arc(18.31,16.41) 18.35,16.31 18.35,14.33 22.52,10.16 25.67,10.16 26.75,9.08 26.75,6.26
LCD_B3: length 29.3
  Top Layer w0.254: 19.05,24.8 18.87,24.99 18.25,24.99 17.9,24.64 17.9,21.1 19.59,19.41 19.59,19.12 arc(19.55,19.01) 19.44,18.97 19.44,18.97 arc(19.28,18.81) 19.44,18.66 19.75,18.66 arc(19.9,18.51) 19.75,18.36 19.44,18.36 arc(19.28,18.2) 19.44,18.05 19.75,18.05 arc(19.9,17.9) 19.75,17.75 19.44,17.75 arc(19.28,17.59) 19.44,17.44 19.75,17.44 arc(19.9,17.29) 19.75,17.14 19.44,17.14 arc(19.28,16.98) 19.44,16.83 19.75,16.83 arc(19.9,16.68) 19.75,16.53 19.75,16.53 arc(19.64,16.48) 19.59,16.38 19.59,14.02 ; 19.6,14.03 19.59,14.02 ; 19.59,14.02 19.59,13.96 ; 19.59,13.96 19.59,13.95 ; 19.59,13.96 22.91,10.64 26.07,10.64 27.24,9.47 27.24,6.23
LCD_B4: length 30
  Top Layer w0.254: 20.98,13.74 20.88,13.83 20.88,13.85 ; 20.9,21.06 21.05,21.06 21.05,20.27 20.88,20.1 arc(20.93,19.99) 21.04,19.95 21.13,19.95 arc(21.28,19.79) 21.13,19.64 20.64,19.64 arc(20.49,19.49) 20.64,19.34 21.13,19.34 arc(21.28,19.18) 21.13,19.03 20.64,19.03 arc(20.49,18.88) 20.64,18.73 21.13,18.73 arc(21.28,18.58) 21.13,18.42 20.64,18.42 arc(20.49,18.27) 20.64,18.12 21.13,18.12 arc(21.28,17.97) 21.13,17.81 20.64,17.81 arc(20.49,17.66) 20.64,17.51 21.13,17.51 arc(21.28,17.36) 21.13,17.2 20.64,17.2 arc(20.49,17.05) 20.64,16.9 21.13,16.9 arc(21.28,16.75) 21.13,16.59 20.64,16.59 arc(20.49,16.44) 20.64,16.29 21.13,16.29 arc(21.28,16.14) 21.13,15.98 20.64,15.98 arc(20.49,15.83) 20.64,15.68 21.13,15.68 arc(21.28,15.53) 21.13,15.37 20.64,15.37 arc(20.49,15.22) 20.64,15.07 20.73,15.07 arc(20.84,15.03) 20.88,14.92 20.88,13.86 20.88,13.85 ; 20.88,13.85 20.87,13.85 ; 20.88,13.85 20.88,13.88 ; 20.99,13.73 23.51,11.21 26.39,11.21 27.75,9.85 27.75,6.33
LCD_B5: length 30
  Top Layer w0.254: 28.26,6.22 28.24,6.23 28.24,10.18 26.69,11.74 24.01,11.74 22.25,13.5 22.25,13.86 arc(22.2,13.97) 22.09,14.02 22.06,14.02 arc(21.91,14.17) 22.06,14.32 22.44,14.32 arc(22.59,14.47) 22.44,14.62 22.05,14.62 arc(21.9,14.78) 22.05,14.93 22.44,14.93 arc(22.59,15.08) 22.44,15.23 22.05,15.23 arc(21.9,15.39) 22.05,15.54 22.44,15.54 arc(22.59,15.69) 22.44,15.84 22.05,15.84 arc(21.9,16) 22.05,16.15 22.44,16.15 arc(22.59,16.3) 22.44,16.45 22.05,16.45 arc(21.9,16.61) 22.05,16.76 22.44,16.76 arc(22.59,16.91) 22.44,17.06 22.05,17.06 arc(21.9,17.22) 22.05,17.37 22.44,17.37 arc(22.59,17.52) 22.44,17.67 22.05,17.67 arc(21.9,17.83) 22.05,17.98 22.44,17.98 arc(22.59,18.13) 22.44,18.28 22.05,18.28 arc(21.9,18.43) 22.05,18.59 22.44,18.59 arc(22.59,18.74) 22.44,18.89 22.05,18.89 arc(21.9,19.04) 22.05,19.2 22.44,19.2 arc(22.59,19.35) 22.44,19.5 22.05,19.5 arc(21.9,19.65) 22.05,19.81 22.44,19.81 arc(22.59,19.96) 22.44,20.11 22.4,20.11 arc(22.29,20.16) 22.25,20.26 22.25,20.84 22.32,20.91
LCD_CS: length 30.5
  Top Layer w0.254: v1(23.16,8.78) 23.16,7.6 23.25,7.5 23.25,6.2 ; 19.72,33.84 20.16,33.84 20.85,33.15 20.85,26.1 23.29,23.66 24.04,23.66
  Bottom Layer w0.254: v1(23.16,8.78) 23.16,22.69 v1(24.06,23.6)
LCD_DE: length 34.7
  Top Layer w0.254: 24.26,6.17 24.26,7.78 24.37,7.89 v1(24.37,8.89) ; 36.71,31.23 35.56,31.23 33.78,29.44 33.78,25.11 33.1,24.44 26.59,24.44 25.77,23.61 v1(25.77,23.5)
  Bottom Layer w0.254: v1(24.37,8.89) 24.41,8.93 24.41,21.97 25.77,23.32 v1(25.77,23.5)
LCD_G0: length 29.2
  Top Layer w0.254: 28.75,6.02 28.75,6.03 28.75,10.5 26.86,12.39 24.79,12.39 23.51,13.67 23.51,14.03 arc(23.55,14.13) 23.66,14.18 23.71,14.18 arc(23.86,14.33) 23.71,14.48 23.31,14.48 arc(23.16,14.64) 23.31,14.79 23.71,14.79 arc(23.86,14.94) 23.71,15.09 23.31,15.09 arc(23.16,15.25) 23.31,15.4 23.71,15.4 arc(23.86,15.55) 23.71,15.7 23.31,15.7 arc(23.16,15.86) 23.31,16.01 23.71,16.01 arc(23.86,16.16) 23.71,16.31 23.31,16.31 arc(23.16,16.46) 23.31,16.62 23.71,16.62 arc(23.86,16.77) 23.71,16.92 23.31,16.92 arc(23.16,17.07) 23.31,17.23 23.71,17.23 arc(23.86,17.38) 23.71,17.53 23.31,17.53 arc(23.16,17.68) 23.31,17.84 23.71,17.84 arc(23.86,17.99) 23.71,18.14 23.31,18.14 arc(23.16,18.29) 23.31,18.45 23.71,18.45 arc(23.86,18.6) 23.71,18.75 23.31,18.75 arc(23.16,18.9) 23.31,19.06 23.71,19.06 arc(23.86,19.21) 23.71,19.36 23.31,19.36 arc(23.16,19.51) 23.31,19.67 23.71,19.67 arc(23.86,19.82) 23.71,19.97 23.66,19.97 arc(23.55,20.01) 23.51,20.12 23.51,21.11 23.51,21.12
LCD_G1: length 29.8
  Top Layer w0.254: 29.24,6.26 29.24,10.79 27.03,13 25.64,13 24.8,13.84 24.8,13.98 arc(24.84,14.09) 24.95,14.13 25.04,14.13 arc(25.19,14.28) 25.04,14.44 24.56,14.44 arc(24.4,14.59) 24.56,14.74 25.04,14.74 arc(25.19,14.89) 25.04,15.05 24.56,15.05 arc(24.4,15.2) 24.56,15.35 25.04,15.35 arc(25.19,15.5) 25.04,15.66 24.56,15.66 arc(24.4,15.81) 24.56,15.96 25.04,15.96 arc(25.19,16.11) 25.04,16.27 24.56,16.27 arc(24.41,16.42) 24.56,16.57 25.04,16.57 arc(25.19,16.72) 25.04,16.88 24.56,16.88 arc(24.4,17.03) 24.56,17.18 25.04,17.18 arc(25.19,17.33) 25.04,17.49 24.56,17.49 arc(24.4,17.64) 24.56,17.79 25.04,17.79 arc(25.19,17.94) 25.04,18.09 24.56,18.09 arc(24.4,18.25) 24.56,18.4 25.04,18.4 arc(25.19,18.55) 25.04,18.7 24.56,18.7 arc(24.4,18.86) 24.56,19.01 25.04,19.01 arc(25.19,19.16) 25.04,19.31 24.56,19.31 arc(24.41,19.47) 24.56,19.62 25.04,19.62 arc(25.19,19.77) 25.04,19.92 24.95,19.92 arc(24.84,19.97) 24.8,20.08 24.8,20.89 24.72,20.97
LCD_G2: length 29.7
  Top Layer w0.254: 26.02,21.1 26.11,21.02 26.11,20.28 arc(26.16,20.17) 26.26,20.13 26.34,20.13 arc(26.5,19.98) 26.34,19.83 25.88,19.83 arc(25.72,19.67) 25.88,19.52 26.34,19.52 arc(26.5,19.37) 26.34,19.22 25.88,19.22 arc(25.72,19.06) 25.88,18.91 26.34,18.91 arc(26.5,18.76) 26.34,18.61 25.88,18.61 arc(25.72,18.45) 25.88,18.3 26.34,18.3 arc(26.5,18.15) 26.34,18 25.88,18 arc(25.72,17.84) 25.88,17.69 26.34,17.69 arc(26.5,17.54) 26.34,17.39 25.88,17.39 arc(25.72,17.23) 25.88,17.08 26.34,17.08 arc(26.5,16.93) 26.34,16.78 25.88,16.78 arc(25.72,16.62) 25.88,16.47 26.34,16.47 arc(26.5,16.32) 26.34,16.17 25.88,16.17 arc(25.72,16.02) 25.88,15.86 26.34,15.86 arc(26.5,15.71) 26.34,15.56 25.88,15.56 arc(25.72,15.41) 25.88,15.25 26.34,15.25 arc(26.5,15.1) 26.34,14.95 25.88,14.95 arc(25.72,14.8) 25.88,14.64 26.34,14.64 arc(26.5,14.49) 26.34,14.34 25.88,14.34 arc(25.72,14.19) 25.88,14.03 25.96,14.03 arc(26.07,13.99) 26.11,13.88 26.36,13.63 27.3,13.63 29.75,11.18 29.75,6.24 29.74,6.23
LCD_G3: length 30
  Top Layer w0.254: 27.36,20.94 27.36,20.24 arc(27.4,20.13) 27.51,20.09 27.66,20.09 arc(27.82,19.93) 27.66,19.78 27.05,19.78 arc(26.9,19.63) 27.05,19.48 27.66,19.48 arc(27.82,19.32) 27.66,19.17 27.05,19.17 arc(26.9,19.02) 27.05,18.87 27.66,18.87 arc(27.82,18.72) 27.66,18.56 27.05,18.56 arc(26.9,18.41) 27.05,18.26 27.66,18.26 arc(27.82,18.11) 27.66,17.95 27.05,17.95 arc(26.9,17.8) 27.05,17.65 27.66,17.65 arc(27.82,17.5) 27.66,17.34 27.05,17.34 arc(26.9,17.19) 27.05,17.04 27.66,17.04 arc(27.82,16.89) 27.66,16.73 27.05,16.73 arc(26.9,16.58) 27.05,16.43 27.66,16.43 arc(27.82,16.28) 27.66,16.12 27.05,16.12 arc(26.9,15.97) 27.05,15.82 27.66,15.82 arc(27.82,15.67) 27.66,15.51 27.05,15.51 arc(26.9,15.36) 27.05,15.21 27.66,15.21 arc(27.82,15.06) 27.66,14.91 27.05,14.91 arc(26.9,14.75) 27.05,14.6 27.21,14.6 arc(27.31,14.56) 27.36,14.45 27.36,14.43 30.25,11.54 30.25,6.2 30.27,6.19
LCD_G4: length 30.2
  Top Layer w0.254: 30.74,6.35 30.75,6.35 30.75,12.14 30.73,12.15 ; 30.71,12.2 28.66,14.25 28.66,14.44 arc(28.62,14.55) 28.51,14.59 28.34,14.59 arc(28.19,14.75) 28.34,14.9 28.99,14.9 arc(29.14,15.05) 28.99,15.2 28.34,15.2 arc(28.19,15.36) 28.34,15.51 28.99,15.51 arc(29.14,15.66) 28.99,15.81 28.34,15.81 arc(28.19,15.97) 28.34,16.12 28.99,16.12 arc(29.14,16.27) 28.99,16.42 28.34,16.42 arc(28.19,16.58) 28.34,16.73 28.99,16.73 arc(29.14,16.88) 28.99,17.03 28.34,17.03 arc(28.19,17.18) 28.34,17.34 28.99,17.34 arc(29.14,17.49) 28.99,17.64 28.34,17.64 arc(28.19,17.79) 28.34,17.95 28.99,17.95 arc(29.14,18.1) 28.99,18.25 28.34,18.25 arc(28.19,18.4) 28.34,18.56 28.99,18.56 arc(29.14,18.71) 28.99,18.86 28.34,18.86 arc(28.19,19.01) 28.34,19.17 28.99,19.17 arc(29.14,19.32) 28.99,19.47 28.34,19.47 arc(28.19,19.62) 28.34,19.78 28.99,19.78 arc(29.14,19.93) 28.99,20.08 28.82,20.08 arc(28.71,20.12) 28.66,20.23 28.66,21.07
LCD_G5: length 29.9
  Top Layer w0.254: 31.27,6.18 31.25,6.2 31.25,12.68 29.85,14.08 29.85,14.14 arc(29.9,14.25) 30.01,14.29 30.23,14.29 arc(30.38,14.44) 30.23,14.6 29.66,14.6 arc(29.5,14.75) 29.66,14.9 30.23,14.9 arc(30.38,15.05) 30.23,15.21 29.66,15.21 arc(29.5,15.36) 29.66,15.51 30.23,15.51 arc(30.38,15.66) 30.23,15.82 29.66,15.82 arc(29.5,15.97) 29.66,16.12 30.23,16.12 arc(30.38,16.27) 30.23,16.43 29.66,16.43 arc(29.5,16.58) 29.66,16.73 30.23,16.73 arc(30.38,16.88) 30.23,17.04 29.66,17.04 arc(29.5,17.19) 29.66,17.34 30.23,17.34 arc(30.38,17.49) 30.23,17.65 29.66,17.65 arc(29.5,17.8) 29.66,17.95 30.23,17.95 arc(30.38,18.1) 30.23,18.25 29.66,18.25 arc(29.5,18.41) 29.66,18.56 30.23,18.56 arc(30.38,18.71) 30.23,18.86 29.66,18.86 arc(29.5,19.02) 29.66,19.17 30.23,19.17 arc(30.38,19.32) 30.23,19.47 29.66,19.47 arc(29.5,19.63) 29.66,19.78 30.23,19.78 arc(30.38,19.93) 30.23,20.08 30.01,20.08 arc(29.9,20.13) 29.85,20.24 29.85,21.15
LCD_HSYNC: length 31.6
  Top Layer w0.254: 35.27,28.48 35.02,28.23 35.02,24.4 33.88,23.26 27.56,23.25 v1(27.14,22.83) ; 25.25,6.17 25.25,7.17 25.62,7.54 v1(25.62,7.92) ; 36.71,28.51 35.27,28.51
  Bottom Layer w0.254: v1(27.14,22.83) 25.6,21.29 25.6,7.93 v1(25.62,7.92)
LCD_PCLK: length 36.3
  Top Layer w0.254: 35.69,32.48 35.76,32.55 36.56,32.55 36.73,32.38 ; v1(25.01,24.16) 25.01,24.19 25.77,24.95 32.64,24.95 33.27,25.57 33.27,30.08 35.68,32.48 ; 23.74,6.34 23.74,6.35 23.74,8.19 v1(23.77,8.22)
  Bottom Layer w0.254: v1(25.01,24.16) 25.01,23.5 23.78,22.27 23.78,8.23 v1(23.77,8.22)
LCD_R1: length 28
  Top Layer w0.254: 32.27,6.19 32.24,6.22 32.24,11.93 31.95,12.22 31.95,12.98 31.14,13.79 31.14,14.73 arc(31.18,14.84) 31.29,14.89 31.36,14.89 arc(31.51,15.04) 31.36,15.19 30.9,15.19 arc(30.75,15.34) 30.9,15.49 31.49,15.49 arc(31.64,15.65) 31.49,15.8 30.9,15.8 arc(30.75,15.95) 30.9,16.1 31.49,16.1 arc(31.64,16.26) 31.49,16.41 30.9,16.41 arc(30.75,16.56) 30.9,16.71 31.49,16.71 arc(31.64,16.87) 31.49,17.02 30.9,17.02 arc(30.75,17.17) 30.9,17.32 31.49,17.32 arc(31.64,17.48) 31.49,17.63 30.9,17.63 arc(30.75,17.78) 30.9,17.93 31.49,17.93 arc(31.64,18.09) 31.49,18.24 30.9,18.24 arc(30.75,18.39) 30.9,18.54 31.49,18.54 arc(31.64,18.69) 31.49,18.85 30.9,18.85 arc(30.75,19) 30.9,19.15 31.49,19.15 arc(31.64,19.3) 31.49,19.46 30.9,19.46 arc(30.75,19.61) 30.9,19.76 31.49,19.76 arc(31.64,19.91) 31.49,20.07 31.29,20.07 arc(31.18,20.11) 31.14,20.22 31.14,21.04
LCD_R2: length 30
  Top Layer w0.254: 32.75,6.17 32.75,12.15 32.5,12.41 32.5,13.43 arc(32.55,13.54) 32.65,13.58 32.69,13.58 arc(32.84,13.74) 32.69,13.89 32.23,13.89 arc(32.08,14.04) 32.23,14.19 32.77,14.19 arc(32.92,14.35) 32.77,14.5 32.23,14.5 arc(32.08,14.65) 32.23,14.8 32.77,14.8 arc(32.92,14.96) 32.77,15.11 32.23,15.11 arc(32.08,15.26) 32.23,15.41 32.77,15.41 arc(32.92,15.57) 32.77,15.72 32.23,15.72 arc(32.08,15.87) 32.23,16.02 32.77,16.02 arc(32.92,16.18) 32.77,16.33 32.23,16.33 arc(32.08,16.48) 32.23,16.63 32.77,16.63 arc(32.92,16.79) 32.77,16.94 32.23,16.94 arc(32.08,17.09) 32.23,17.24 32.77,17.24 arc(32.92,17.39) 32.77,17.55 32.23,17.55 arc(32.08,17.7) 32.23,17.85 32.77,17.85 arc(32.92,18) 32.77,18.16 32.23,18.16 arc(32.08,18.31) 32.23,18.46 32.77,18.46 arc(32.92,18.61) 32.77,18.77 32.23,18.77 arc(32.08,18.92) 32.23,19.07 32.77,19.07 arc(32.92,19.22) 32.77,19.38 32.23,19.38 arc(32.08,19.53) 32.23,19.68 32.77,19.68 arc(32.92,19.83) 32.77,19.99 32.65,19.99 arc(32.55,20.03) 32.5,20.14 32.5,21.13 32.38,21.25
LCD_R3: length 30.1
  Top Layer w0.254: 33.27,6.07 33.25,6.09 33.25,12.21 33.7,12.66 33.7,13.39 arc(33.75,13.5) 33.86,13.54 33.91,13.54 arc(34.07,13.7) 33.91,13.85 33.37,13.85 arc(33.22,14) 33.37,14.15 34.04,14.15 arc(34.19,14.31) 34.04,14.46 33.44,14.46 arc(33.29,14.61) 33.44,14.76 34.04,14.76 arc(34.19,14.92) 34.04,15.07 33.44,15.07 arc(33.29,15.22) 33.44,15.37 34.04,15.37 arc(34.19,15.53) 34.04,15.68 33.44,15.68 arc(33.29,15.83) 33.44,15.98 34.04,15.98 arc(34.19,16.14) 34.04,16.29 33.44,16.29 arc(33.29,16.44) 33.44,16.59 34.04,16.59 arc(34.19,16.75) 34.04,16.9 33.44,16.9 arc(33.29,17.05) 33.44,17.2 34.04,17.2 arc(34.19,17.35) 34.04,17.51 33.44,17.51 arc(33.29,17.66) 33.44,17.81 34.04,17.81 arc(34.19,17.96) 34.04,18.12 33.44,18.12 arc(33.29,18.27) 33.44,18.42 34.04,18.42 arc(34.19,18.57) 34.04,18.73 33.44,18.73 arc(33.29,18.88) 33.44,19.03 34.04,19.03 arc(34.19,19.18) 34.04,19.34 33.44,19.34 arc(33.29,19.49) 33.44,19.64 33.55,19.64 arc(33.66,19.69) 33.7,19.79 33.7,20.53 33.59,20.65
LCD_R4: length 29.8
  Top Layer w0.254: 34.88,20.72 34.97,20.63 34.97,20.11 arc(35.02,20) 35.12,19.95 35.24,19.95 arc(35.39,19.8) 35.24,19.65 34.71,19.65 arc(34.55,19.5) 34.71,19.34 35.24,19.34 arc(35.39,19.19) 35.24,19.04 34.71,19.04 arc(34.55,18.89) 34.71,18.73 35.24,18.73 arc(35.39,18.58) 35.24,18.43 34.71,18.43 arc(34.55,18.28) 34.71,18.12 35.24,18.12 arc(35.39,17.97) 35.24,17.82 34.71,17.82 arc(34.55,17.67) 34.71,17.52 35.24,17.52 arc(35.39,17.36) 35.24,17.21 34.71,17.21 arc(34.55,17.06) 34.71,16.91 35.24,16.91 arc(35.39,16.75) 35.24,16.6 34.71,16.6 arc(34.55,16.45) 34.71,16.3 35.24,16.3 arc(35.39,16.14) 35.24,15.99 34.71,15.99 arc(34.55,15.84) 34.71,15.69 35.24,15.69 arc(35.39,15.53) 35.24,15.38 34.71,15.38 arc(34.55,15.23) 34.71,15.08 35.24,15.08 arc(35.39,14.92) 35.24,14.77 34.71,14.77 arc(34.55,14.62) 34.71,14.47 35.24,14.47 arc(35.39,14.31) 35.24,14.16 34.71,14.16 arc(34.55,14.01) 34.71,13.86 35.24,13.86 arc(35.39,13.7) 35.24,13.55 35.12,13.55 arc(35.02,13.51) 34.97,13.4 34.97,12.83 33.75,11.61 33.75,6.19
LCD_R5: length 29.7
  Top Layer w0.254: 36.82,27.47 36.87,27.41 37.8,27.41 38.6,26.61 38.6,21.02 ; 38.59,20.93 38.57,20.93 37.43,19.8 36.72,19.8 36.33,19.4 36.33,18.65 arc(36.28,18.54) 36.17,18.5 36.12,18.5 arc(35.97,18.35) 36.12,18.19 36.53,18.19 arc(36.68,18.04) 36.53,17.89 36.12,17.89 arc(35.97,17.74) 36.12,17.58 36.53,17.58 arc(36.68,17.43) 36.53,17.28 36.12,17.28 arc(35.97,17.13) 36.12,16.98 36.53,16.98 arc(36.68,16.82) 36.53,16.67 36.12,16.67 arc(35.97,16.52) 36.12,16.37 36.53,16.37 arc(36.68,16.21) 36.53,16.06 36.13,16.06 arc(35.98,15.91) 36.13,15.76 36.17,15.76 arc(36.28,15.71) 36.33,15.6 36.33,13.31 34.26,11.24 34.26,6.24
LCD_RST: length 2.3
  Top Layer w0.254: 20.75,6.25 20.75,7.18 20.15,7.78 20.15,8.3
LCD_SCK: length 41.5
  Top Layer w0.254: v1(23.93,24.53) 24.14,24.53 25.04,25.43 32.28,25.42 32.65,25.79 32.65,30.33 34.95,32.63 ; 36.68,36.43 36.56,36.31 35.63,36.31 34.94,35.63 34.94,32.68 ; v1(22.53,8.26) 22.52,8.25 22.52,7.44 22.75,7.21 22.75,5.81 22.76,5.81
  Bottom Layer w0.254: v1(23.93,24.53) 23.91,24.52 23.87,24.52 22.55,23.2 22.55,8.27 v1(22.53,8.26)
LCD_SDA: length 42.2
  Top Layer w0.254: 36.39,37.66 35.44,37.66 34.32,36.54 34.32,32.83 ; v1(21.93,8.85) 21.93,7.27 22.25,6.95 22.25,6.37 ; v1(23.81,25.37) 24.4,25.97 31.65,26 31.99,26.35 31.99,30.49 34.33,32.83
  Bottom Layer w0.254: v1(23.81,25.37) 21.97,23.53 21.97,8.89 v1(21.93,8.85)
LCD_VSYNC: length 33
  Top Layer w0.254: 24.74,6.15 24.75,6.17 24.75,7.53 25.03,7.81 25.03,8.16 25.04,8.16 25.04,8.4 v1(25.02,8.42) ; 35.34,29.77 34.39,28.81 34.39,24.69 33.55,23.86 27.14,23.86 v1(27,23.71) ; 36.53,29.82 35.34,29.82
  Bottom Layer w0.254: v1(25.02,8.42) 25.02,21.73 v1(27,23.71)
LEDA: length 25.5
  Top Layer w0.305: 8.71,15.89 8.64,15.97 ; 9.85,15.89 9.85,14.95 8.83,13.93 8.83,9.66 10.81,7.69 17.09,7.69 18.25,6.53 18.25,5.97 ; 10.79,19.94 10.78,19.96 10.22,19.96 9.98,19.72 9.98,18.3 11.04,17.24 11.04,15.94
  Top Layer w0.381: 8.53,15.89 10.24,15.89 ; 10.51,15.89 11.11,15.89 11.13,15.87
LEDK: length 23.7
  Top Layer w0.254: 18.82,5.69 19.24,5.69 19.27,5.72 ; 5.6,18.98 8.5,18.98 8.51,19
  Top Layer w0.305: 18.76,6.23 18.76,6.99 17.48,8.27 12.57,8.27 v1(12.47,8.37) ; v1(8.51,18.1) 8.51,18.89
  Bottom Layer w0.305: v1(8.51,18.1) 9.43,18.1 11.53,16 11.53,9.31 v1(12.47,8.37)
LRCLK: length 10.5
  Top Layer w0.254: 10.09,30.41 10.09,29.35 10.71,28.73 U1.9
VSYS: length 70.7
  Top Layer w0.381: 12.25,36.1 9.57,36.1 C11.2 9.46,34.83 9.84,34.44 9.84,33.81 ; v1(12.89,34.95) 12.92,34.95 13.59,34.29 13.94,34.29 R21.2
  Top Layer w0.508: 53.78,41.3 51.69,41.3 51.18,40.8 51.18,39.32 50.29,38.44 C2.2 47.74,38.44 47.15,37.84 U3.3 45.84,37.05 45.53,36.73 44.26,36.73 43.94,37.05 U3.1 43.91,37.81 v1(43.23,37.81) ; v1(12.89,34.95) 12.25,35.59 C12.2 ; v1(12.89,25.05) 11.49,25.05 11.49,22.38 10.86,21.75 U6.6
  Bottom Layer w0.508: v1(43.23,37.81) 36.19,37.81 35.24,36.86 18.44,36.86 17.63,36.05 13.49,36.05 12.89,35.44 v1(12.89,34.95) 12.89,25.05
VUSB: length 12.9
  Top Layer w0.305: 69.16,32.41 69.59,32.41 70.54,31.46 70.54,28.77 69.53,27.75 69.02,27.75 69.02,27.75
  Top Layer w0.508: 58.7,30.72 58.7,32.13 ; 46.16,32.51 46.13,32.48 43.99,32.48 ; 50.99,32.55 51,32.54 53.6,32.54 53.78,32.73
$1N1235: length 3.6
  Top Layer w0.254: R2.1 54.16,28.87 54.15,28.86 52.89,28.86 52,27.97 U2.7
$1N1236: length 3.4
  Top Layer w0.254: R4.1 54.53,27.21 52.76,27.21 52.26,26.7 U2.6
$1N1237: length 2.1
  Top Layer w0.254: LED1.1 56.56,30.38 54.55,30.38 R2.2
$1N1238: length 2.1
  Top Layer w0.254: R4.2 54.8,25.69 54.81,25.68 56.5,25.68 LED2.1
$1N1240: length 2.3
  Top Layer w0.254: U2.2 45.53,27.96 43.24,27.96
$1N1241: length 27.3
  Top Layer w0.508: U2.4 v1(44.51,25.43) ; v1(45.02,31.02) 45.34,31.33 51.27,31.33 51.36,31.25 ; 57.72,28.86 58.61,28.86 58.61,28.87 ; 57.72,28.86 56.57,28.86 56.58,28.85 56.58,27.57 ; 57.72,28.86 57.72,30.89 57.27,31.33 51.44,31.33 51.36,31.25 ; 51.36,31.25 U2.8
  Bottom Layer w0.508: v1(45.02,31.02) 44.51,30.51 v1(44.51,25.43)
$1N1243: length 4.6
  Top Layer w0.254: U5.2 43.11,17.81 43.37,18.06 43.37,21.5 43.24,21.63
$1N1244: length 5.5
  Top Layer w0.254: U5.3 42.47,16.28 42.65,16.1 46.48,16.1 46.79,16.41 46.79,16.83
$1N1245: length 15.5
  Top Layer w0.254: U5.1 41.78,18.76 41.34,18.32 41.34,16.28 42.1,15.52 50.48,15.52 51.79,16.83 52.64,16.83
$1N1246: length 11.5
  Top Layer w0.254: 49.72,21.61 49.72,22.13 49.12,22.73 46.25,22.73 45.88,22.35 45.88,21.58 45.97,21.49 45.03,21.49 43.87,20.33 43.87,18.15 44.21,17.81 U5.5
$1N7025: length 2.4
  Top Layer w0.254: 36.76,6.14 36.75,6.15 36.75,8.56
$1N8594: length 6.4
  Top Layer w0.254: 68.94,28.88 66.63,28.88 66.39,29.11 62.96,29.11 62.79,28.94 62.79,28.86
$1N8596: length 6.4
  Top Layer w0.254: 68.71,31.9 68.69,31.88 67.61,31.88 66.37,30.65 62.89,30.65 62.87,30.64 R14.1
$1N11286: length 12.8
  Top Layer w0.305: U6.1 9.27,20.92 9.46,20.73 9.46,17.68 8.9,17.12 6.54,17.12 6.28,16.87 6.28,15.93 D2.2
  Top Layer w0.508: L1.1 7.94,24.79 7.94,22.63 8.56,22 U6.1
$1N12849: length 4.4
  Top Layer w0.254: 11.87,32.68 12.25,32.68 12.89,33.31 15.3,33.31 15.55,33.57 15.55,33.93 15.55,33.94
$1N12853: length 2.3
  Top Layer w0.254: R20.1 14.03,32.04 13.43,32.04 13.06,31.67 11.87,31.67
$1N12856: length 3.9
  Top Layer w0.305: 7.95,32.17 8.83,32.17
  Top Layer w0.381: H1.2 5.29,31.17 6.85,31.17 7.83,32.15
$1N12857: length 4
  Top Layer w0.305: 7.92,32.67 8.83,32.67
  Top Layer w0.381: 6.74,33.81 5.39,33.81 H1.1 ; 6.74,33.81 6.73,33.82 ; 6.74,33.81 6.75,33.81 ; 6.74,33.81 7.83,32.73
$1N14888: length 13.4
  Top Layer w0.508: 46.16,34.86 46.16,35.92 46.13,35.95 ; 46.13,35.95 44.38,35.95 43.99,35.55 43.99,34.38 ; 46.13,35.95 49.41,35.95 52.22,38.76 53.78,38.76
$1N21558: length 17.2
  Top Layer w0.381: 44.77,18.73 44.77,19.79 45.26,20.29 47.45,20.29 ; 51.91,17.77 50.85,17.77 48.32,20.29 47.53,20.29 ; 47.45,20.45 47.45,21.2 47.31,21.34
  Top Layer w0.508: 52.93,17.84 53.74,17.84 54.24,17.34 54.24,13.27 53.31,12.34

## Copper pours and planes (outline as drawn; the poured copper is in the pictures)
3V3 on Top Layer: 39.81,45.24 44.51,45.24 44.51,39.14 39.81,39.14
GND on Top Layer: -6.67,-7.19 -6.67,59.79 79,59.79 79,-7.19
GND on Bottom Layer: -4.07,56.31 83.06,56.31 83.06,-3.13 -4.07,-3.13
VSYS on Top Layer: 8.83,36.76 13.83,36.76 13.83,34.19 8.83,34.19
VUSB on Top Layer: 43.41,32.97 54.87,32.97 54.87,31.89 43.41,31.89
VUSB on Top Layer: 52.89,32.92 66.61,32.92 66.61,31.91 52.89,31.91
$1N21558 on Top Layer: 51.79,18.31 53.42,18.31 53.42,17.32 51.79,17.32

Small or netless copper shapes (teardrops, artwork), in the pictures only: 2 on Top Layer

## Text on the board
Top Silkscreen Layer: 1 | EN | BOOT | 40 | BAT- | BAT+ | GND | BUT | SPK+ | SPK- | SW | R20 | 100K  12dB | 短接  15dB | 不贴  9dB
